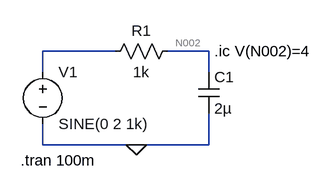
[diagram p0: schematic 19thoctober(rc-circuit).asc]
19thoctober(rc-circuit).asc, the LTspice schematic file:
Version 4
SHEET 1 880 680
WIRE 80 96 -32 96
WIRE 224 96 160 96
WIRE -32 128 -32 96
WIRE 224 128 224 96
WIRE -32 240 -32 208
WIRE 112 240 -32 240
WIRE 224 240 224 192
WIRE 224 240 112 240
FLAG 112 240 0
SYMBOL res 176 80 R90
WINDOW 0 0 56 VBottom 2
WINDOW 3 32 56 VTop 2
SYMATTR InstName R1
SYMATTR Value 1k
SYMBOL cap 208 128 R0
SYMATTR InstName C1
SYMATTR Value 2µ
SYMBOL voltage -32 112 R0
WINDOW 123 0 0 Left 0
WINDOW 39 0 0 Left 0
SYMATTR InstName V1
SYMATTR Value SINE(0 2 1k)
TEXT 232 96 Left 2 !.ic V(N002)=4
TEXT -66 264 Left 2 !.tran 100m

The netlist it stands for:
* 19thoctober(rc-circuit).asc
R1 N002 N001 1k
C1 N002 0 2µ
V1 N001 0 SINE(0 2 1k)
.ic V(N002)=4
.tran 100m
.backanno
.end